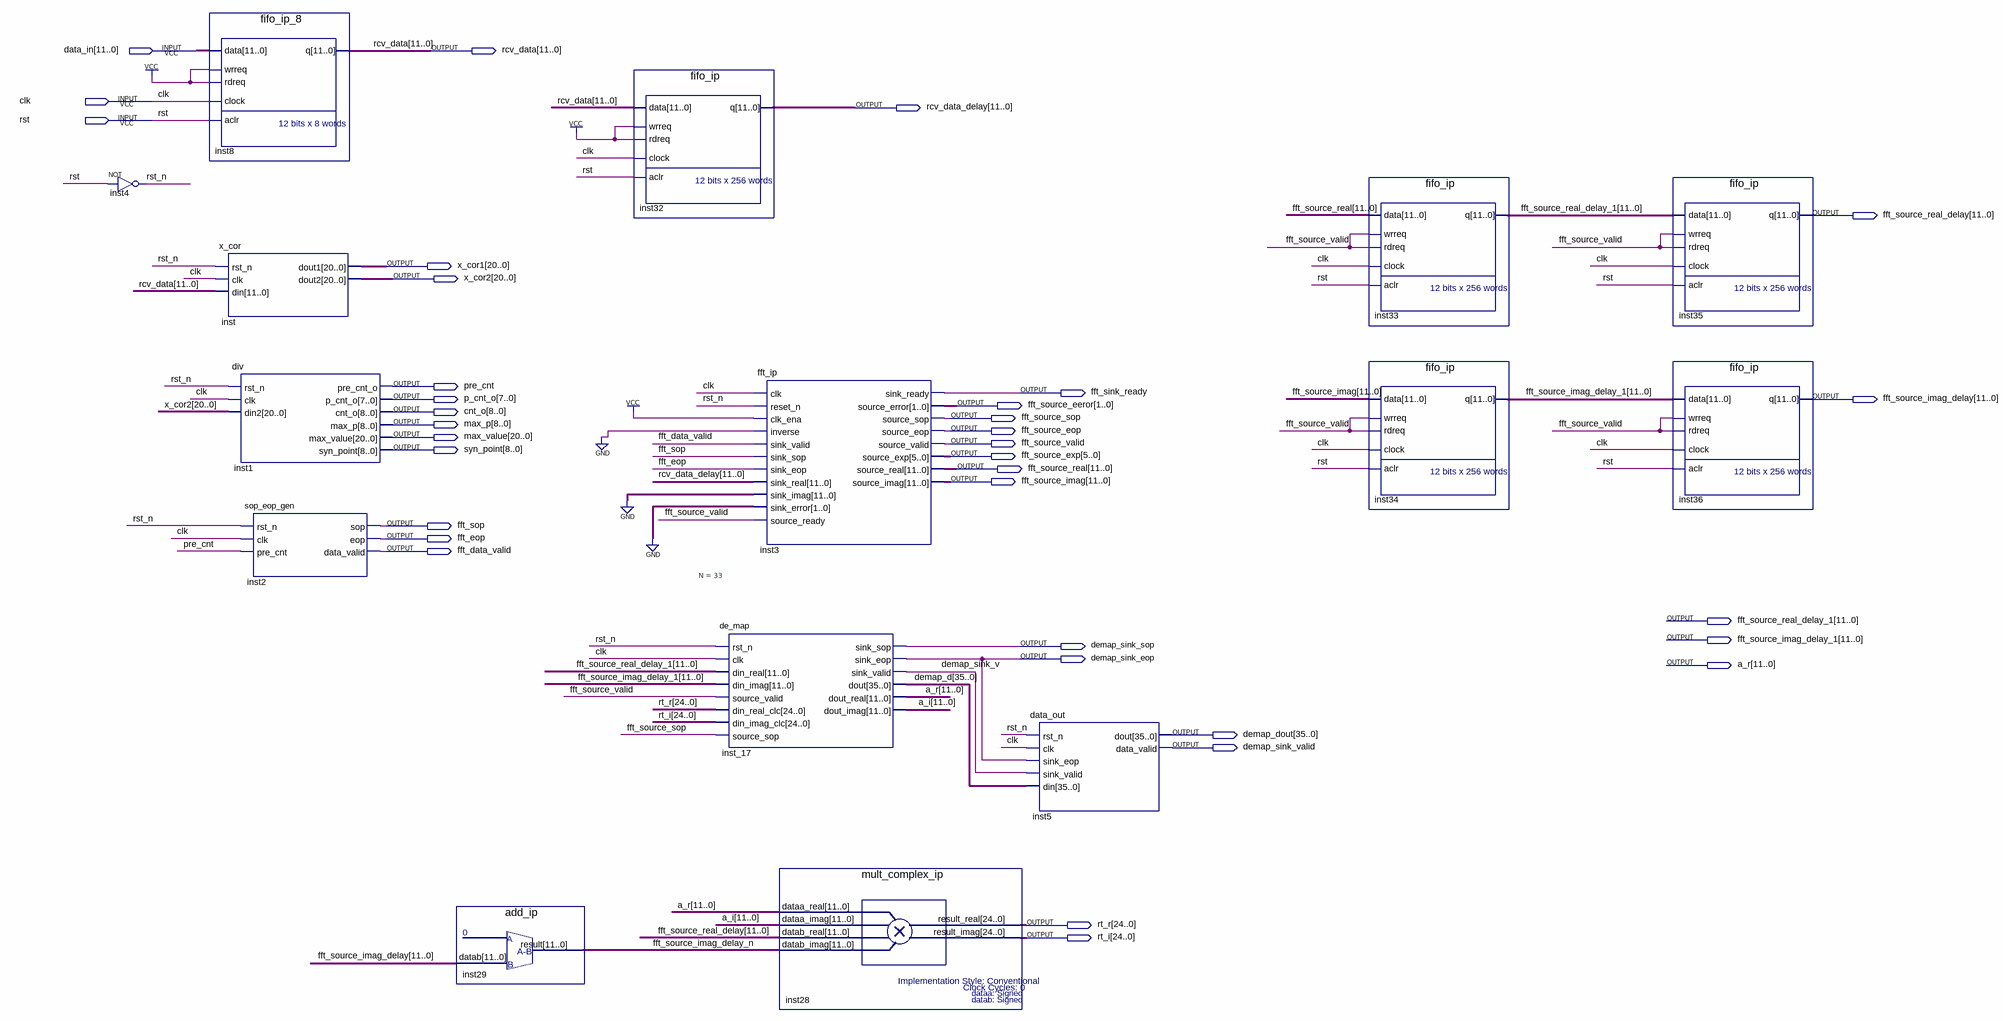
[diagram p0: schematic sheet]
// Quartus schematic receiver.bdf as structural Verilog: 15 symbols, 35 pins
module receiver (
  input  [11:0] data_in,
  input  clk,
  input  rst,
  output [11:0] rcv_data,
  output [11:0] rcv_data_delay,
  output [11:0] fft_source_real_delay,
  output [20:0] x_cor1,
  output [20:0] x_cor2,
  output pre_cnt,
  output fft_sink_ready,
  output [7:0] p_cnt_o,
  output [11:0] fft_source_imag_delay,
  output [1:0] fft_source_eeror,
  output [8:0] cnt_o,
  output fft_source_sop,
  output [8:0] max_p,
  output fft_source_eop,
  output [20:0] max_value,
  output fft_source_valid,
  output [8:0] syn_point,
  output [5:0] fft_source_exp,
  output [11:0] fft_source_real,
  output [11:0] fft_source_imag,
  output fft_sop,
  output fft_eop,
  output fft_data_valid,
  output [11:0] fft_source_real_delay_1,
  output [11:0] fft_source_imag_delay_1,
  output demap_sink_sop,
  output demap_sink_eop,
  output [11:0] a_r,
  output [35:0] demap_dout,
  output demap_sink_valid,
  output [24:0] rt_r,
  output [24:0] rt_i
);

  wire demap_sink_v, fft_source_imag_delay_n, rst_n;
  wire [11:0] a_i;
  wire [35:0] demap_d;

  not inst4 (rst_n, rst);
  fifo_ip_8 inst8 (.data(data_in), .wrreq(1'b1), .rdreq(1'b1), .clock(clk), .aclr(rst), .q(rcv_data));
  x_cor inst (.rst_n(rst_n), .clk(clk), .din(rcv_data), .dout1(x_cor1), .dout2(x_cor2));
  div inst1 (
    .rst_n(rst_n), .clk(clk), .din2(x_cor2), .pre_cnt_o(pre_cnt), .p_cnt_o(p_cnt_o), .cnt_o(cnt_o),
    .max_p(max_p), .max_value(max_value), .syn_point(syn_point));
  sop_eop_gen inst2 (
    .rst_n(rst_n), .clk(clk), .pre_cnt(pre_cnt), .sop(fft_sop), .eop(fft_eop), .data_valid(fft_data_valid));
  add_ip inst29 (.datab(fft_source_imag_delay), .result(fft_source_imag_delay_n));
  fifo_ip inst32 (.data(rcv_data), .wrreq(1'b1), .rdreq(1'b1), .clock(clk), .aclr(rst), .q(rcv_data_delay));
  de_map #(.N(33)) inst_17 (
    .rst_n(rst_n), .clk(clk), .din_real(fft_source_real_delay_1), .din_imag(fft_source_imag_delay_1),
    .source_valid(fft_source_valid), .din_real_clc(rt_r), .din_imag_clc(rt_i), .source_sop(fft_source_sop),
    .sink_sop(demap_sink_sop), .sink_eop(demap_sink_eop), .sink_valid(demap_sink_v), .dout(demap_d),
    .dout_real(a_r), .dout_imag(a_i));
  fft_ip inst3 (
    .clk(clk), .reset_n(rst_n), .clk_ena(1'b1), .inverse(1'b0), .sink_valid(fft_data_valid),
    .sink_sop(fft_sop), .sink_eop(fft_eop), .sink_real(rcv_data_delay), .sink_imag({12{1'b0}}),
    .sink_error(2'b00), .source_ready(fft_source_valid), .sink_ready(fft_sink_ready),
    .source_error(fft_source_eeror), .source_sop(fft_source_sop), .source_eop(fft_source_eop),
    .source_valid(fft_source_valid), .source_exp(fft_source_exp), .source_real(fft_source_real),
    .source_imag(fft_source_imag));
  mult_complex_ip inst28 (
    .dataa_real(a_r), .dataa_imag(a_i), .datab_real(fft_source_real_delay),
    .datab_imag({12{fft_source_imag_delay_n}}), .result_real(rt_r), .result_imag(rt_i));
  data_out inst5 (
    .rst_n(rst_n), .clk(clk), .sink_eop(demap_sink_eop), .sink_valid(demap_sink_v), .din(demap_d),
    .dout(demap_dout), .data_valid(demap_sink_valid));
  fifo_ip inst33 (
    .data(fft_source_real), .wrreq(fft_source_valid), .rdreq(fft_source_valid), .clock(clk), .aclr(rst),
    .q(fft_source_real_delay_1));
  fifo_ip inst34 (
    .data(fft_source_imag), .wrreq(fft_source_valid), .rdreq(fft_source_valid), .clock(clk), .aclr(rst),
    .q(fft_source_imag_delay_1));
  fifo_ip inst35 (
    .data(fft_source_real_delay_1), .wrreq(fft_source_valid), .rdreq(fft_source_valid), .clock(clk),
    .aclr(rst), .q(fft_source_real_delay));
  fifo_ip inst36 (
    .data(fft_source_imag_delay_1), .wrreq(fft_source_valid), .rdreq(fft_source_valid), .clock(clk),
    .aclr(rst), .q(fft_source_imag_delay));
endmodule
